# EAGLE schematic 8ChannelIoTLEDDriver (EAGLE 9.6.2)
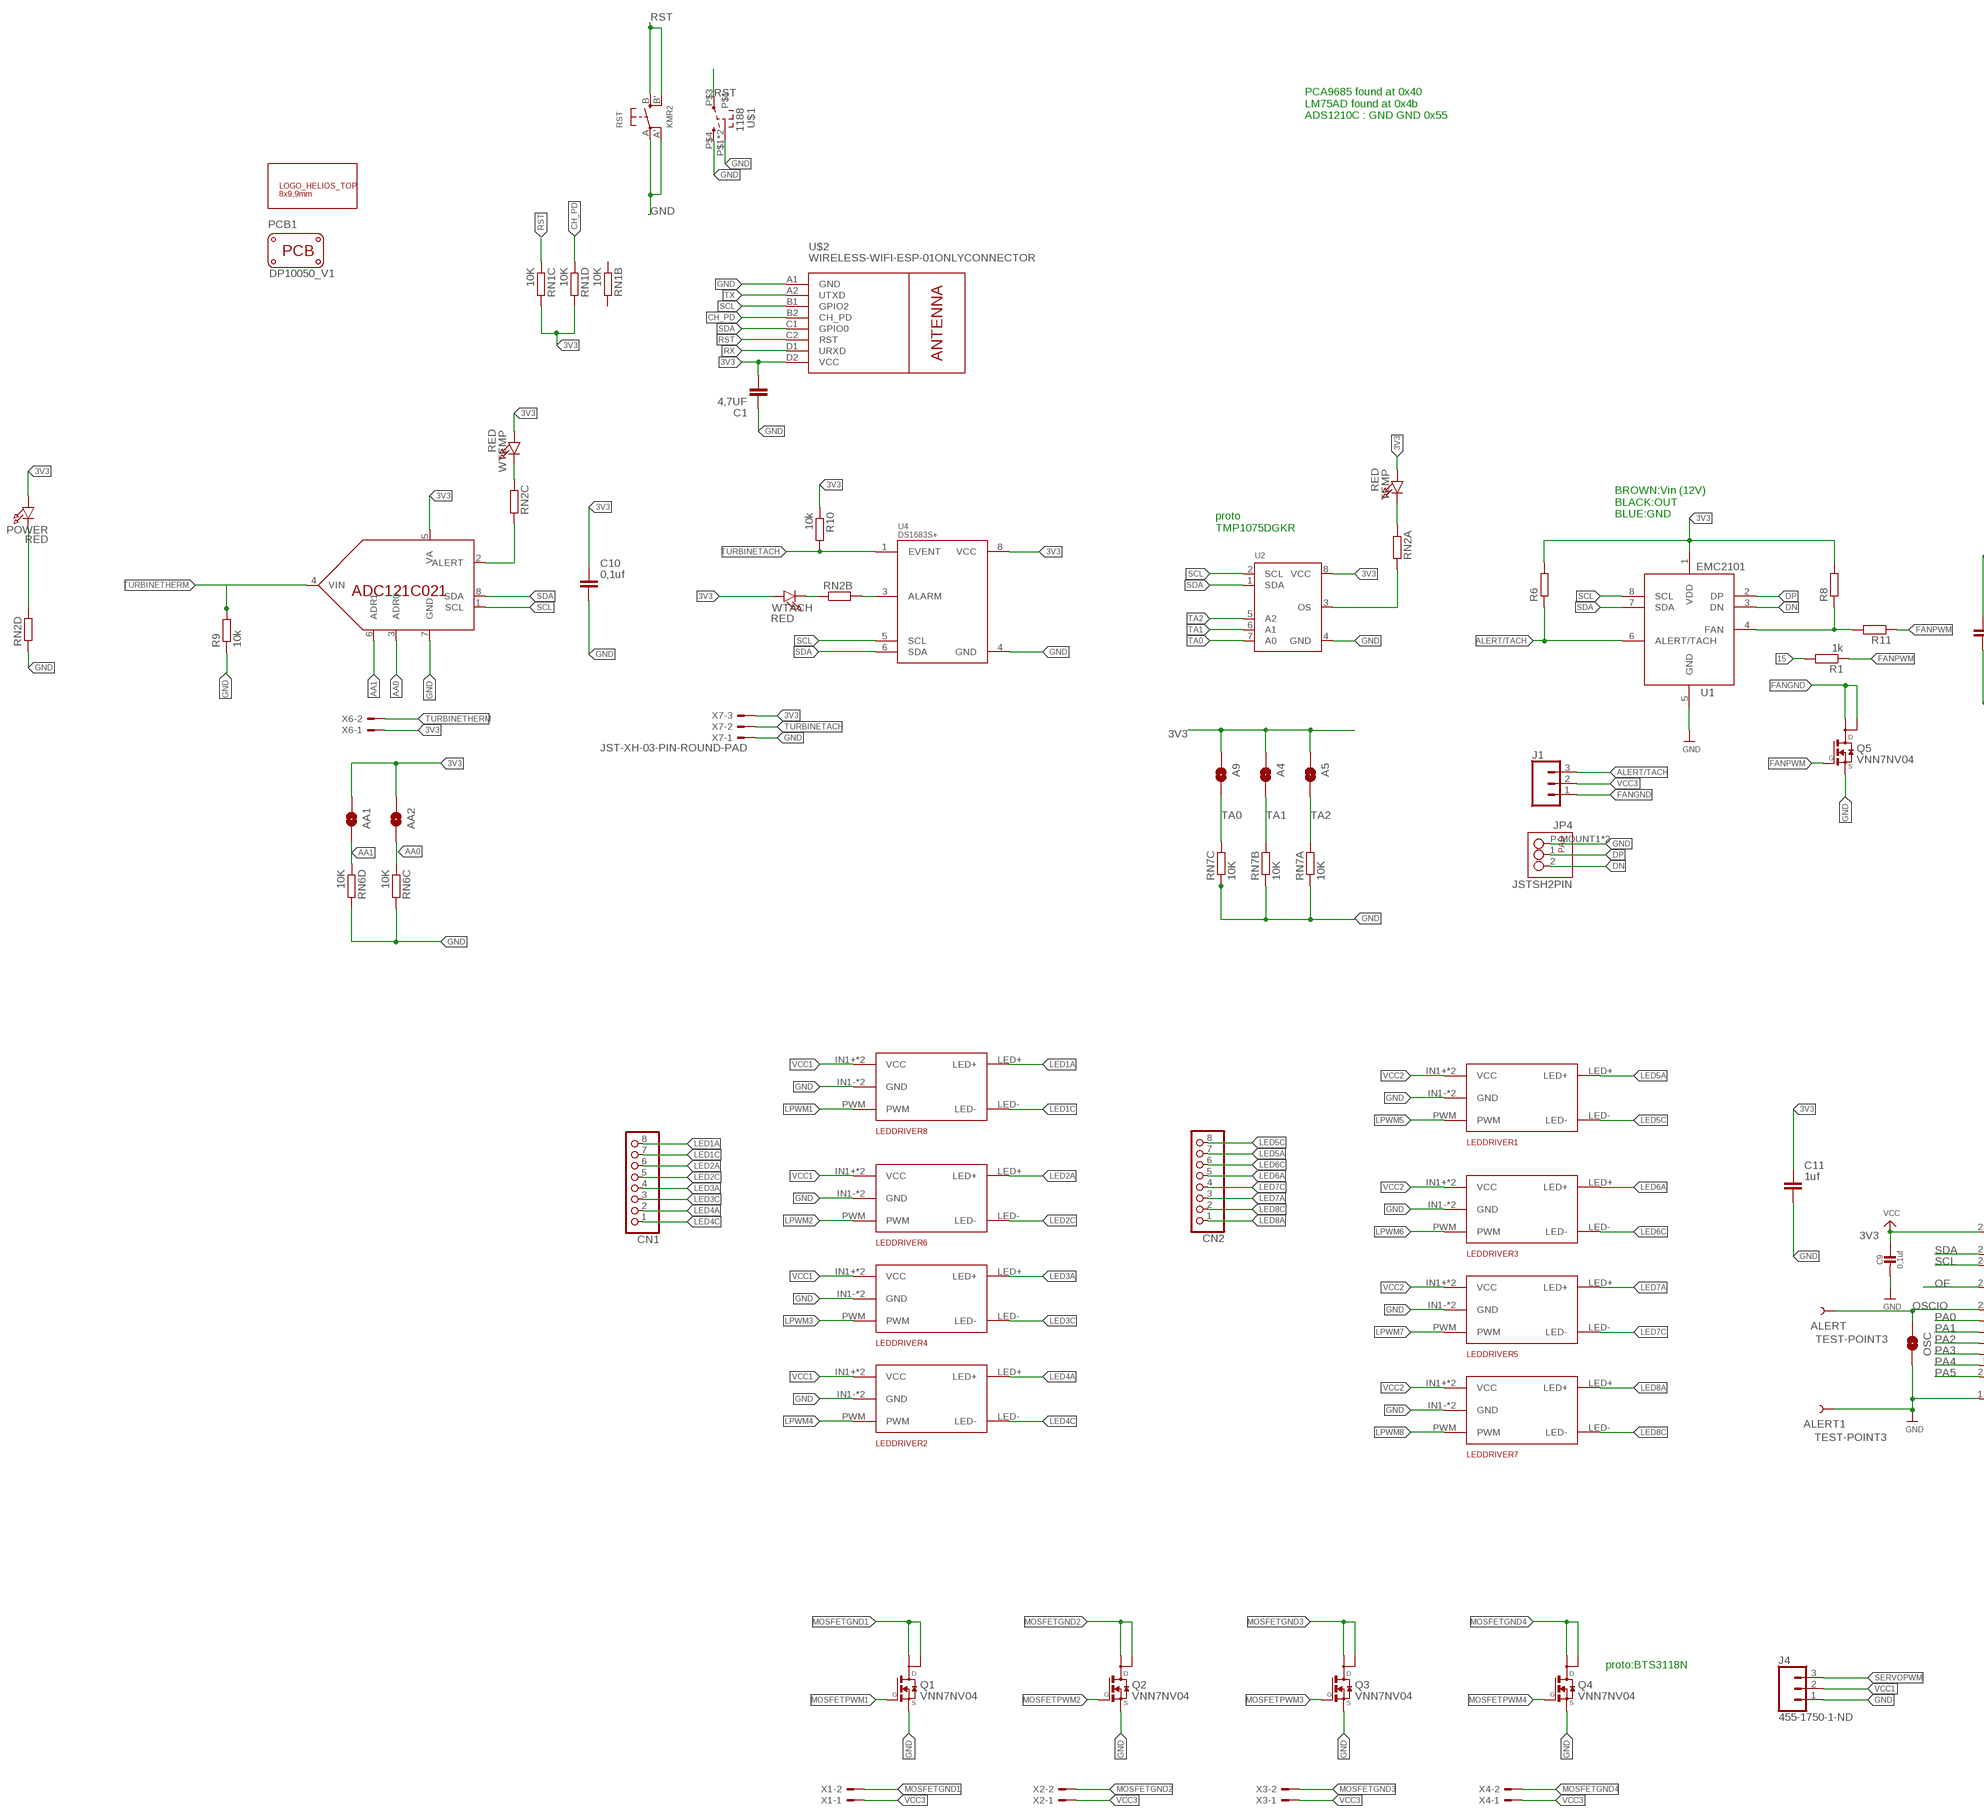
[diagram p0: schematic, sheet 1, part 1 of 2]
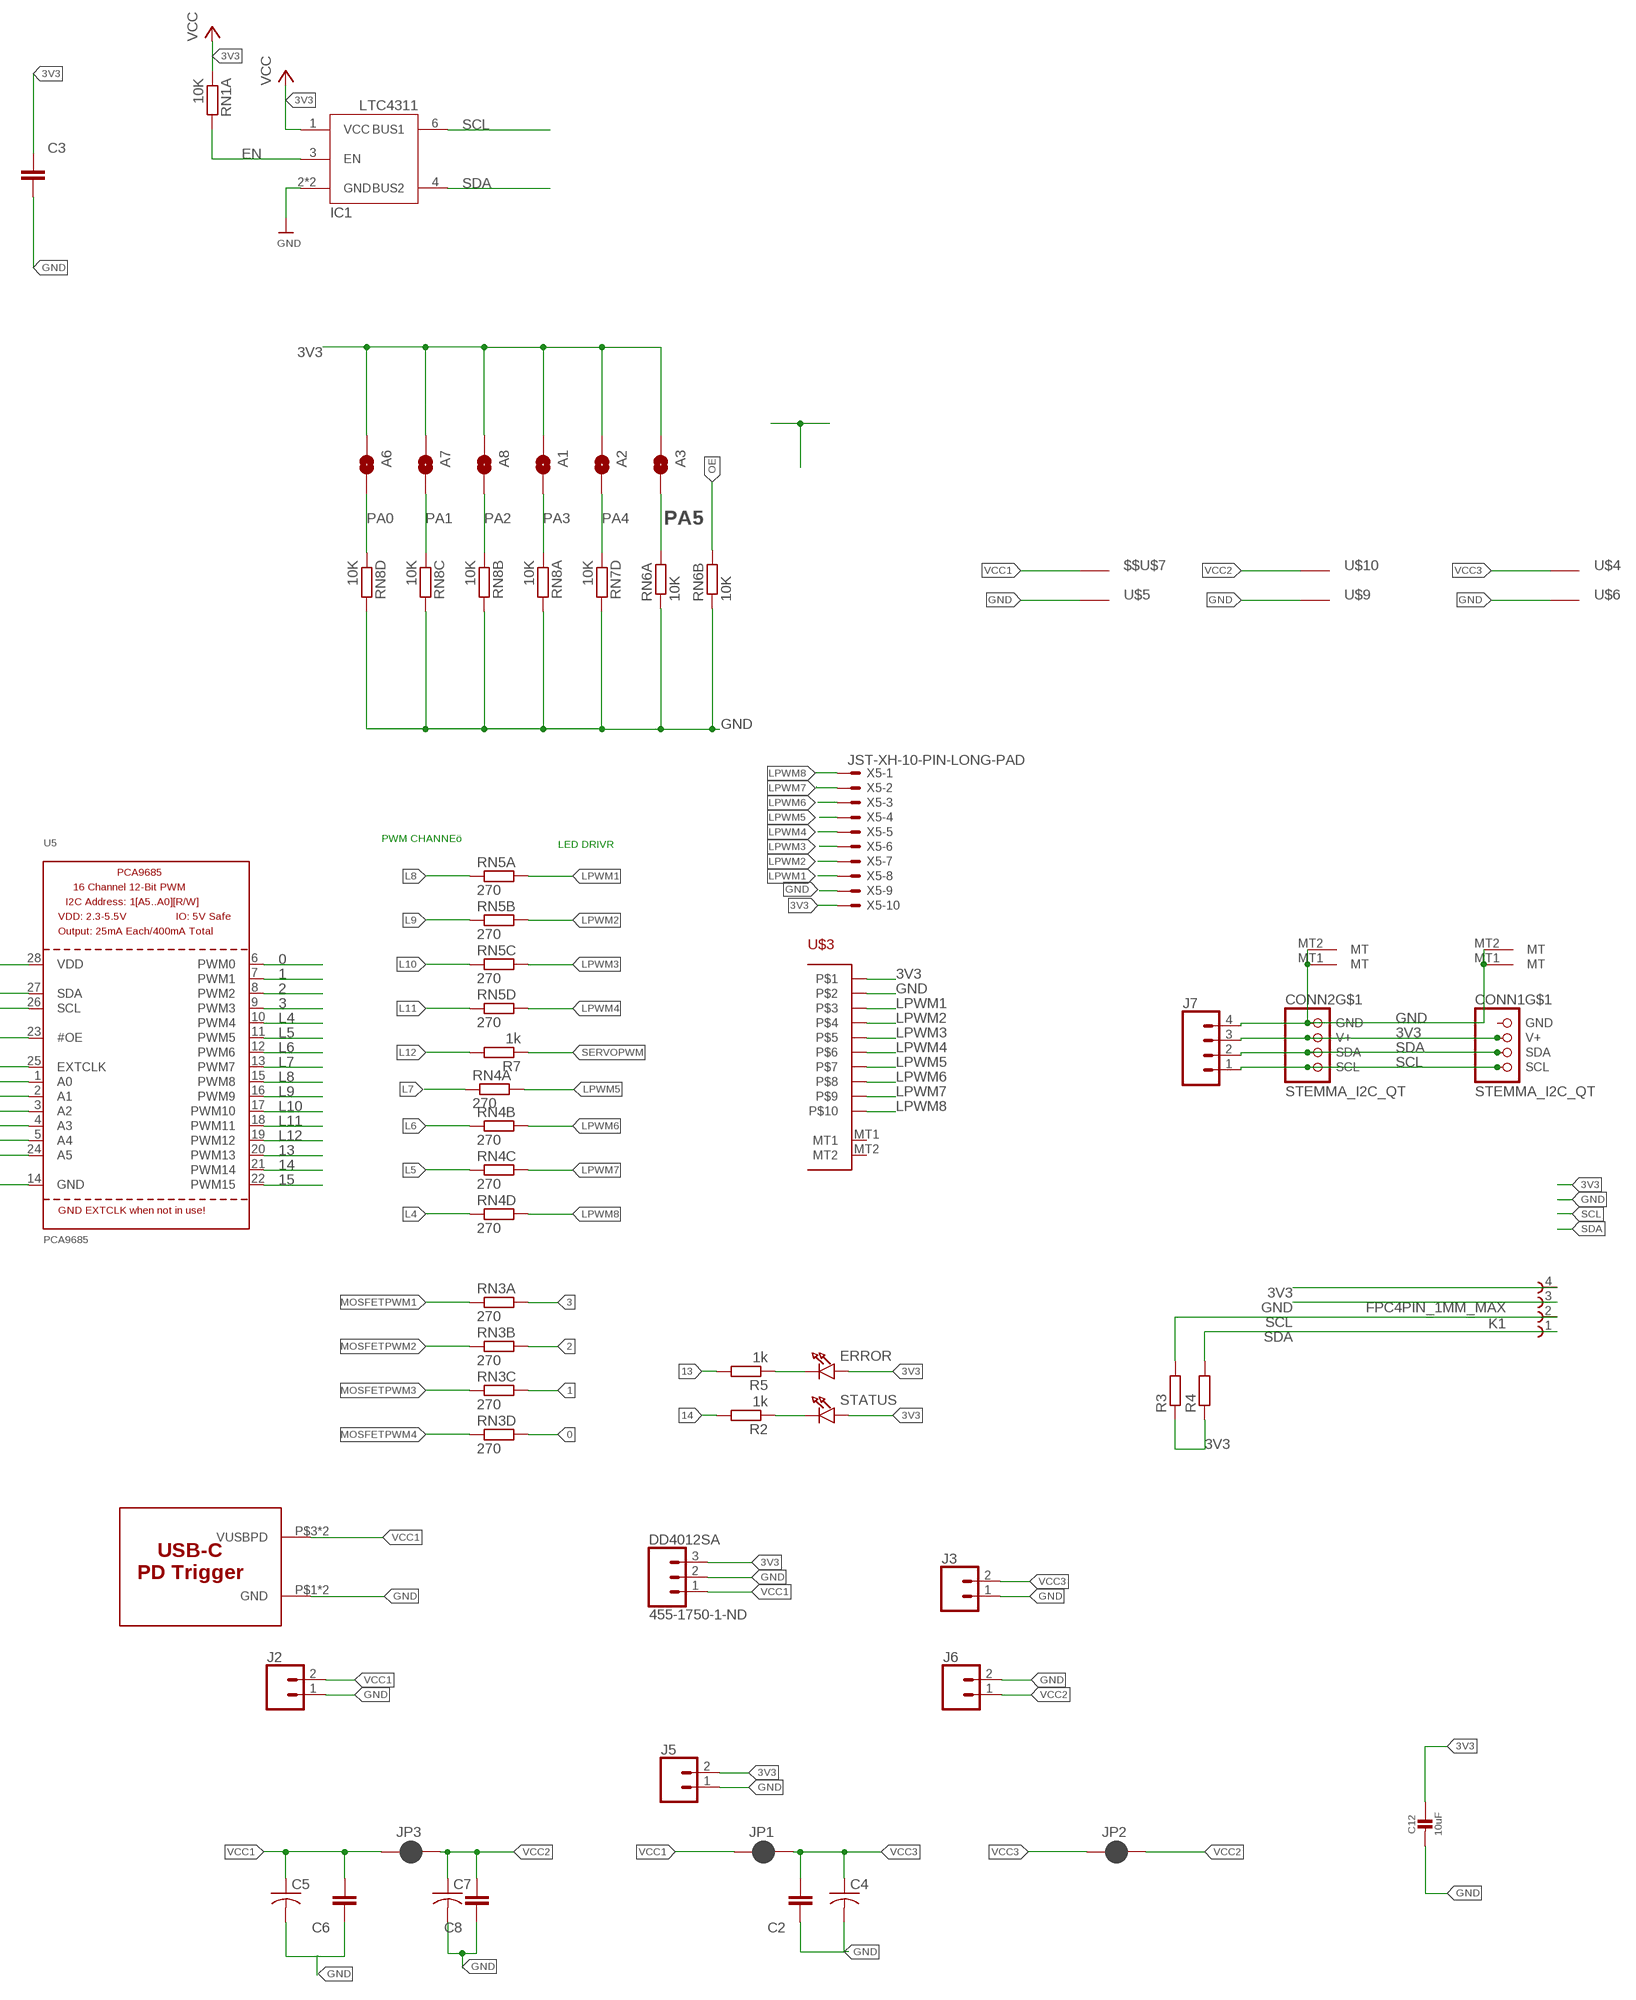
[diagram p1: schematic, sheet 1, part 2 of 2]

## Parts
$$U$7  TESTHOOK  [TESTHOOK]
A1  JUMPER-SMT_2_NO_SILK  [SMT-JUMPER_2_NO_SILK]
A2  JUMPER-SMT_2_NO_SILK  [SMT-JUMPER_2_NO_SILK]
A3  JUMPER-SMT_2_NO_SILK  [SMT-JUMPER_2_NO_SILK]
A4  JUMPER-SMT_2_NO_SILK  [SMT-JUMPER_2_NO_SILK]
A5  JUMPER-SMT_2_NO_SILK  [SMT-JUMPER_2_NO_SILK]
A6  JUMPER-SMT_2_NO_SILK  [SMT-JUMPER_2_NO_SILK]
A7  JUMPER-SMT_2_NO_SILK  [SMT-JUMPER_2_NO_SILK]
A8  JUMPER-SMT_2_NO_SILK  [SMT-JUMPER_2_NO_SILK]
A9  JUMPER-SMT_2_NO_SILK  [SMT-JUMPER_2_NO_SILK]
AA1  JUMPER-SMT_2_NO_SILK  [SMT-JUMPER_2_NO_SILK]
AA2  JUMPER-SMT_2_NO_SILK  [SMT-JUMPER_2_NO_SILK]
ALERT  TEST-POINT3  [PAD.03X.03]
ALERT1  TEST-POINT3  [PAD.03X.03]
C1  4,7UF  CAPACITOR_NPOL-0805  [C805]
C2  CAPACITOR_NPOL-0805  [C805]
C3  CAPACITOR_NPOL-0805  [C805]
C4  C-USC1210  [C1210]
C5  C-USC1210  [C1210]
C6  CAPACITOR_NPOL-0805  [C805]
C7  C-USC1210  [C1210]
C8  CAPACITOR_NPOL-0805  [C805]
C9  0,1uf  CAP_CERAMIC0805-NOOUTLINE  [0805-NO]
C10  0,1uf  CAPACITOR_NPOL-0805  [C805]
C11  1uf  CAPACITOR_NPOL-0805  [C805]
C12  10uF  CAP_CERAMIC0805-NOOUTLINE  [0805-NO]
CN1  JST_8PIN  [JSTPH8]
CN2  JST_8PIN  [JSTPH8]
CONN1  STEMMA_I2C_QT  [JST_SH4]
CONN2  STEMMA_I2C_QT  [JST_SH4]
DD4012SA  455-1750-1-ND  CONN_03  [1X03]
ERROR  RED  LED0805  [CHIPLED_0805]
IC1  LTC4311_SC70  [SC70-6L]
J1  CONN_03POLAR  [MOLEX-1X3]
J2  CONN_02POLAR  [MOLEX-1X2]
J3  CONN_02POLAR  [MOLEX-1X2]
J4  455-1750-1-ND  CONN_03  [1X03]
J5  CONN_02POLAR  [MOLEX-1X2]
J6  CONN_023.5MM  [SCREWTERMINAL-3.5MM-2]
J7  CONN_04JST-PH-4-1.0MM  [JST-4-SMD-VERT-1.0MM]
JP1  JUMPER-SMT_2_NC_PASTE_SILK  [SMT-JUMPER_2_NC_PASTE_SILK]
JP2  JUMPER-SMT_2_NC_PASTE_SILK  [SMT-JUMPER_2_NC_PASTE_SILK]
JP3  JUMPER-SMT_2_NC_PASTE_SILK  [SMT-JUMPER_2_NC_PASTE_SILK]
JP4  JSTSH2PIN  [SM02B-SRSS-TB]
K1  FPC4PIN_1MM_MAX  [FPC_CONN_DOC_4PIN_ENLARGED]
LEDDRIVER1  LEDDRIVERPT4115LONG  [7PINLONGLEDDRIVER]
LEDDRIVER2  LEDDRIVERPT4115LONG  [7PINLONGLEDDRIVER]
LEDDRIVER3  LEDDRIVERPT4115LONG  [7PINLONGLEDDRIVER]
LEDDRIVER4  LEDDRIVERPT4115LONG  [7PINLONGLEDDRIVER]
LEDDRIVER5  LEDDRIVERPT4115LONG  [7PINLONGLEDDRIVER]
LEDDRIVER6  LEDDRIVERPT4115LONG  [7PINLONGLEDDRIVER]
LEDDRIVER7  LEDDRIVERPT4115LONG  [7PINLONGLEDDRIVER]
LEDDRIVER8  LEDDRIVERPT4115LONG  [7PINLONGLEDDRIVER]
OSC  JUMPER-SMT_2_NO_SILK  [SMT-JUMPER_2_NO_SILK]
PCB1  PCB_DP_RECTANGLE-50X100  [DP10050_V1]
POWER  RED  LED0805  [CHIPLED_0805]
Q1  VNN7NV04  [SOT223]
Q2  VNN7NV04  [SOT223]
Q3  VNN7NV04  [SOT223]
Q4  VNN7NV04  [SOT223]
Q5  VNN7NV04  [SOT223]
R1  1k  RESISTORR805-0805  [R805]
R2  1k  RESISTORR805-0805  [R805]
R3  RESISTORR805-0805  [R805]
R4  RESISTORR805-0805  [R805]
R5  1k  RESISTORR805-0805  [R805]
R6  RESISTORR805-0805  [R805]
R7  1k  RESISTORR805-0805  [R805]
R8  RESISTORR805-0805  [R805]
R9  10k  RESISTORR805-0805  [R805]
R10  10k  RESISTORR805-0805  [R805]
R11  RESISTORR805-0805  [R805]
RN1  10K  RESISTOR_ARRAY_4  [RN8P-4R-CRA06S]
RN2  RESISTOR_ARRAY_4  [RN8P-4R-CRA06S]
RN3  270  RESISTOR_ARRAY_4  [RN8P-4R-CRA06S]
RN4  270  RESISTOR_ARRAY_4  [RN8P-4R-CRA06S]
RN5  270  RESISTOR_ARRAY_4  [RN8P-4R-CRA06S]
RN6  10K  RESISTOR_ARRAY_4  [RN8P-4R-CRA06S]
RN7  10K  RESISTOR_ARRAY_4  [RN8P-4R-CRA06S]
RN8  10K  RESISTOR_ARRAY_4  [RN8P-4R-CRA06S]
RST  KMR2  SWITCH_TACT_SMT4.6X2.8  [BTN_KMR2_4.6X2.8]
STATUS  RED  LED0805  [CHIPLED_0805]
TEMP  RED  LED0805  [CHIPLED_0805]
U1  EMC2101-AZCL  [MSOP8_0.65MM]
U2  TEMP_LM75B  [TSSOP8]
U3  ADC121C021  [MSOP08]
U4  DS1683S+  [SOIC8-N_MC]
U5  PCA9685  [TSSOP28]
U$1  1188  [1188]
U$2  WIRELESS-WIFI-ESP-01ONLYCONNECTOR  [WIRELESS-WIFI-ESP-01-ONLYBOTTOM]
U$3  FPC-1.0X10  [FPC_1.0X10]
U$4  TESTHOOK  [TESTHOOK]
U$5  TESTHOOK  [TESTHOOK]
U$6  TESTHOOK  [TESTHOOK]
U$8  USB_PD_TRIGGER  [USB-PDTRIGGER]
U$9  TESTHOOK  [TESTHOOK]
U$10  TESTHOOK  [TESTHOOK]
U$11  LOGOTOPHELIOS  [LOGOTOPHELIOS]
WTACH  RED  LED0805  [CHIPLED_0805]
WTEMP  RED  LED0805  [CHIPLED_0805]
X1  JST-XH-02-PIN-ROUND-PAD  [JST-XH-02-PACKAGE-ROUND-PAD]
X2  JST-XH-02-PIN-ROUND-PAD  [JST-XH-02-PACKAGE-ROUND-PAD]
X3  JST-XH-02-PIN-ROUND-PAD  [JST-XH-02-PACKAGE-ROUND-PAD]
X4  JST-XH-02-PIN-ROUND-PAD  [JST-XH-02-PACKAGE-ROUND-PAD]
X5  JST-XH-10-PIN-LONG-PAD  [JST-XH-10-PACKAGE-LONG-PAD]
X6  JST-XH-02-PIN-ROUND-PAD  [JST-XH-02-PACKAGE-ROUND-PAD]
X7  JST-XH-03-PIN-ROUND-PAD  [JST-XH-03-PACKAGE-ROUND-PAD]

## Nets
0: RN3.5 U5.6(PWM0)
1: RN3.6 U5.7(PWM1)
2: RN3.7 U5.8(PWM2)
3: RN3.8 U5.9(PWM3)
3V3: A1.1 A2.1 A3.1 A4.1 A5.1 A6.1 A7.1 A8.1 A9.1 AA1.1 AA2.1 C1.2 C3.1 C9.1 C10.1 C11.1 C12.1 CONN1.2(V+) CONN2.2(V+) DD4012SA.3 ERROR.A IC1.1(VCC) J5.2 J7.3 K1.4 POWER.A R3.1 R4.1 R6.2 R8.2 R10.1 RN1.1 RN1.5 RN1.6 STATUS.A TEMP.A U1.1(VDD) U2.8(VCC) U3.5(VA) U4.8(VCC) U5.28(VDD) U$2.D2(VCC) U$3.1 WTACH.A WTEMP.A X5.10 X6.1 X7.3 ; supply symbol labelled VCC
13: R5.2 U5.20(PWM13)
14: R2.2 U5.21(PWM14)
15: R1.2 U5.22(PWM15)
AA0: AA2.2 RN6.3 U3.3(ADR0)
AA1: AA1.2 RN6.4 U3.6(ADR1)
ALARM1: RN2.6 U3.2(ALERT)
ALARM2: RN2.8 U2.3(OS)
ALERT/TACH: J1.3 R6.1 U1.6(ALERT/TACH)
CH_PD: RN1.4 U$2.B2(CH_PD)
DN [ThermoDiode]: JP4.2 U1.3(DN)
DP [ThermoDiode]: JP4.1 U1.2(DP)
EN: IC1.3(EN) RN1.8
FANGND: J1.1 Q5.2(D) Q5.4(D2)
FANPWM: Q5.1(G) R1.1 R11.1
GND: ALERT1.P$1 C1.1 C2.1 C3.2 C4.2 C5.2 C6.1 C7.2 C8.1 C9.2 C10.2 C11.2 C12.2 CONN1.MT1(MT) CONN1.MT2(MT) CONN2.1(GND) CONN2.MT1(MT) CONN2.MT2(MT) DD4012SA.2 IC1.2(GND) IC1.5(GND) J2.1 J3.1 J4.1 J5.1 J6.2 J7.4 JP4.P-MOUNT1 JP4.P-MOUNT2 K1.3 LEDDRIVER1.IN1-(GND) LEDDRIVER1.IN2-(GND) LEDDRIVER2.IN1-(GND) LEDDRIVER2.IN2-(GND) LEDDRIVER3.IN1-(GND) LEDDRIVER3.IN2-(GND) LEDDRIVER4.IN1-(GND) LEDDRIVER4.IN2-(GND) LEDDRIVER5.IN1-(GND) LEDDRIVER5.IN2-(GND) LEDDRIVER6.IN1-(GND) LEDDRIVER6.IN2-(GND) LEDDRIVER7.IN1-(GND) LEDDRIVER7.IN2-(GND) LEDDRIVER8.IN1-(GND) LEDDRIVER8.IN2-(GND) OSC.2 Q1.3(S) Q2.3(S) Q3.3(S) Q4.3(S) Q5.3(S) R9.1 RN2.4 RN6.1 RN6.2 RN6.5 RN6.6 RN7.1 RN7.2 RN7.3 RN7.5 RN8.5 RN8.6 RN8.7 RN8.8 RST.A'(P1) RST.A(P) U1.5(GND) U2.4(GND) U3.7(GND) U4.4(GND) U5.14(GND) U$1.P$1 U$1.P$2 U$1.P$4 U$2.A1(GND) U$3.2 U$5.P$1 U$6.P$1 U$8.P$1(GND) U$8.P$2(GND) U$9.P$1 X5.9 X7.1
L4: RN4.4 U5.10(PWM4)
L5: RN4.3 U5.11(PWM5)
L6: RN4.2 U5.12(PWM6)
L7: RN4.1 U5.13(PWM7)
L8: RN5.1 U5.15(PWM8)
L9: RN5.2 U5.16(PWM9)
L10: RN5.3 U5.17(PWM10)
L11: RN5.4 U5.18(PWM11)
L12: R7.2 U5.19(PWM12)
LED1A: CN1.8 LEDDRIVER8.LED+
LED1C: CN1.7 LEDDRIVER8.LED-
LED2A: CN1.6 LEDDRIVER6.LED+
LED2C: CN1.5 LEDDRIVER6.LED-
LED3A: CN1.4 LEDDRIVER4.LED+
LED3C: CN1.3 LEDDRIVER4.LED-
LED4A: CN1.2 LEDDRIVER2.LED+
LED4C: CN1.1 LEDDRIVER2.LED-
LED5A: CN2.7 LEDDRIVER1.LED+
LED5C: CN2.8 LEDDRIVER1.LED-
LED6A: CN2.5 LEDDRIVER3.LED+
LED6C: CN2.6 LEDDRIVER3.LED-
LED7A: CN2.3 LEDDRIVER5.LED+
LED7C: CN2.4 LEDDRIVER5.LED-
LED8A: CN2.1 LEDDRIVER7.LED+
LED8C: CN2.2 LEDDRIVER7.LED-
LPWM1: LEDDRIVER8.PWM RN5.8 U$3.3 X5.8
LPWM2: LEDDRIVER6.PWM RN5.7 U$3.4 X5.7
LPWM3: LEDDRIVER4.PWM RN5.6 U$3.5 X5.6
LPWM4: LEDDRIVER2.PWM RN5.5 U$3.6 X5.5
LPWM5: LEDDRIVER1.PWM RN4.8 U$3.7 X5.4
LPWM6: LEDDRIVER3.PWM RN4.7 U$3.8 X5.3
LPWM7: LEDDRIVER5.PWM RN4.6 U$3.9 X5.2
LPWM8: LEDDRIVER7.PWM RN4.5 U$3.10 X5.1
MOSFETGND1: Q1.2(D) Q1.4(D2) X1.2
MOSFETGND2: Q2.2(D) Q2.4(D2) X2.2
MOSFETGND3: Q3.2(D) Q3.4(D2) X3.2
MOSFETGND4: Q4.2(D) Q4.4(D2) X4.2
MOSFETPWM1: Q1.1(G) RN3.1
MOSFETPWM2: Q2.1(G) RN3.2
MOSFETPWM3: Q3.1(G) RN3.3
MOSFETPWM4: Q4.1(G) RN3.4
N$1: RN2.1 TEMP.C
N$3: RN2.2 WTACH.C
N$4: RN2.3 WTEMP.C
N$5: RN2.7 U4.3(ALARM)
N$6: POWER.C RN2.5
N$120: R8.1 R11.2 U1.4(FAN)
N$323: R2.1 STATUS.C
N$324: ERROR.C R5.1
OE: RN6.7 U5.23(#OE)
OSCIO: ALERT.P$1 OSC.1 U5.25(EXTCLK)
PA0: A6.2 RN8.4 U5.1(A0)
PA1: A7.2 RN8.3 U5.2(A1)
PA2: A8.2 RN8.2 U5.3(A2)
PA3: A1.2 RN8.1 U5.4(A3)
PA4: A2.2 RN7.4 U5.5(A4)
PA5: A3.2 RN6.8 U5.24(A5)
RST: RN1.3 RST.B'(S1) RST.B(S) U$1.P$3 U$2.C2(RST)
RX: U$2.D1(URXD)
SCL: CONN1.4(SCL) CONN2.4(SCL) IC1.6(BUS1) J7.1 K1.2 R3.2 U1.8(SCL) U2.2(SCL) U3.1(SCL) U4.5(SCL) U5.26(SCL) U$2.B1(GPIO2)
SDA: CONN1.3(SDA) CONN2.3(SDA) IC1.4(BUS2) J7.2 K1.1 R4.2 U1.7(SDA) U2.1(SDA) U3.8(SDA) U4.6(SDA) U5.27(SDA) U$2.C1(GPIO0)
SERVOPWM: J4.3 R7.1
TA0: A9.2 RN7.6 U2.7(A0)
TA1: A4.2 RN7.7 U2.6(A1)
TA2: A5.2 RN7.8 U2.5(A2)
TURBINETACH: R10.2 U4.1(EVENT) X7.2
TURBINETHERM: R9.2 U3.4(VIN) X6.2
TX: U$2.A2(UTXD)
VCC1: $$U$7.P$1 C5.1 C6.2 DD4012SA.1 J2.2 J4.2 JP1.1 JP3.1 LEDDRIVER2.IN1+(VCC) LEDDRIVER2.IN2+(VCC) LEDDRIVER4.IN1+(VCC) LEDDRIVER4.IN2+(VCC) LEDDRIVER6.IN1+(VCC) LEDDRIVER6.IN2+(VCC) LEDDRIVER8.IN1+(VCC) LEDDRIVER8.IN2+(VCC) U$8.P$3(VUSBPD) U$8.P$4(VUSBPD)
VCC2: C7.1 C8.2 J6.1 JP2.2 JP3.2 LEDDRIVER1.IN1+(VCC) LEDDRIVER1.IN2+(VCC) LEDDRIVER3.IN1+(VCC) LEDDRIVER3.IN2+(VCC) LEDDRIVER5.IN1+(VCC) LEDDRIVER5.IN2+(VCC) LEDDRIVER7.IN1+(VCC) LEDDRIVER7.IN2+(VCC) U$10.P$1
VCC3: C2.2 C4.1 J1.2 J3.2 JP1.2 JP2.1 U$4.P$1 X1.1 X2.1 X3.1 X4.1
Unconnected: CONN1.1(GND) RN1.2 RN1.7 U$3.MT1 U$3.MT2

## Notes on the sheet
- PCA9685 found at 0x40
  LM75AD found at 0x4b
  ADS1210C : GND GND 0x55
- BROWN:Vin (12V)
  BLACK:OUT
  BLUE:GND
- proto
  TMP1075DGKR
- PWM CHANNEö
- LED DRIVR
- proto:BTS3118N

## Library data of the parts
$$U$7 U$4-U$6 U$9 U$10 = pimoroni-connectors:TESTHOOK
A1-A9 AA1 AA2 OSC = SparkFun-Jumpers:JUMPER-SMT_2_NO: Normally open jumper This jumper has two pads in close proximity to each other. Apply solder to close the connection. Round pads are easier to solder for beginners, but are a lot larger. SparkFun Product that uses the round pads: SparkFun EL Sequencer <https://www.sparkfun.com/products/12781>
ALERT ALERT1 = SparkFun-Connectors:TEST-POINT: SparkFun Test Points Bare copper test points for troubleshooting or In-Circuit-Testing. These are used by our Production team for verifying production board runs using pogo-pins on test beds. SparkFun Products: SparkFun LSM9DS1 Breakout <https://www.sparkfun.com/products/13284> SparkFun PSOC <https://www.sparkfun.com/products/13714> SparkFun Load Cell Amplifier <https://www.sparkfun.com/products/13879>
C1-C3 C6 C8 C10 C11 = dp_devices:CAPACITOR_NPOL: Non-Polarized capacitor in various packages
C4 C5 C7 = adafruit:C-US: CAPACITOR, American symbol
C9 C12 = microbuilder:CAP_CERAMIC: Ceramic Capacitors For new designs, use the packages preceded by an '_' character since they are more reliable: The following footprints should be used on most boards: _0402 - Standard footprint for regular board layouts _0603 - Standard footprint for regular board layouts _0805 - Standard footprint for regular board layouts _1206 - Standard footprint for regular board layouts For extremely tight-pitch boards where space is at a premium, the following 'micro-pitch' footprints can be used (smaller pads, no silkscreen outline, etc.): _0402MP - Micro-pitch footprint for very dense/compact boards _0603MP - Micro-pitch footprint for very dense/compact boards _0805MP - Micro-pitch footprint for very dense/compact boards _1206MP - Micro-pitch footprint for very dense/compact boards
CN1 CN2 = microbuilder:JST_8PIN: JST 8-Pin Right-Angle Connector
CONN1 CONN2 = microbuilder:STEMMA_I2C
DD4012SA J4 = SparkFun-Connectors:CONN_03: Multi connection point. Often used as Generic Header-pin footprint for 0.1 inch spaced/style header connections On any of the 0.1 inch spaced packages, you can populate with these: Break Away Headers - Straight <https://www.sparkfun.com/products/116> (PRT-00116) Break Away Male Headers - Right Angle <https://www.sparkfun.com/products/553> (PRT-00553) Female Headers <https://www.sparkfun.com/products/115> (PRT-00115) Break Away Headers - Machine Pin <https://www.sparkfun.com/products/117> (PRT-00117) Break Away Female Headers - Swiss Machine Pin <https://www.sparkfun.com/products/743> (PRT-00743) Stackable Header - 3 Pin (Female, 0.1") <https://www.sparkfun.com/products/13875> (PRT-13875) For SCREWTERMINALS and SPRING TERMINALS visit here: Screw Terimnals on SparkFun.com <https://www.sparkfun.com/search/results?term=Screw+Terminals> (5mm/3.5mm/2.54mm spacing) This device is also useful as a general connection point to wire up your design to another part of your project. Our various solder wires solder well into these plated through hole pads. Hook-Up Wire - Assortment (Stranded, 22 AWG) <https://www.sparkfun.com/products/11375> (PRT-11375) Hook-Up Wire - Assortment (Solid Core, 22 AWG) <https://www.sparkfun.com/products/11367> (PRT-11367) View the entire wire category on our website here <https://www.sparkfun.com/categories/141> Special notes: Molex polarized connector foot print use with SKU : PRT-08232 with associated crimp pins and housings.; PROD_ID: XXX-00000
ERROR POWER STATUS TEMP WTACH WTEMP = microbuilder:LED: LED 0603 - 0603 Surface Mount Package 2mA: Green LED - Low Power (3.9mcd, 2ma, 1.7Vf) - Digikey: 475-2709-2-ND Orange LED - Low Power (9.8mcd, 2ma, 1.8Vf) - Digikey: 475-1194-2-ND Red LED - Low Power (5mcd, 2ma, 1.8Vf) - Digikey: 475-1195-2-ND Yellow LED - Low Power (7mcd, 2ma, 1.8Vf) - Digikey: 475-1196-2-ND 5mA: Blue LED - Low Power (17mcd, 5ma, 2.9Vf) - Digikey: LNJ937W8CRACT-ND 0805 - 0805 Surface Mount Package 2mA: Red LED (8.8mcd, 2mA, 1.8Vf, Clear) - Low Power [Digikey: 475-2510-1-ND] Green LED (5mcd, 2mA, 1.8Vf, Clear) - Low Power [Digikey: 475-2730-1-ND] Yellow LED (11.3mcd, 2mA, 1.8Vf, Clear) - Low Power [Digikey: 475-2555-1-ND] 20mA: Red LED (104mcd, 20mA, Diffused) - LS R976 [Digikey: 475-1278-6-ND] Red LED (12mcd, 20mA, 2.0Vf, Clear) - APT2012EC [Digikey: 754-1128-1-ND] Green LED (15mcd, 20mA, 2.2Vf, Clear) - APT2012GC [Digikey: 754-1131-1-ND] Orange LED (160mcd, 20mA, 2.1Vf, Clear) - APT2012SECK [Digikey: 754-1130-1-ND] 1206 - 1206 Surface Mount Package Green LED (26mcd, 20mA, Diffused) - LG N971 [Digikey: 475-1407-6-ND] Red LED (15mcd, 20mA, Diffused) - LH N974 [Digikey: 475-1416-6-ND]
IC1 = microbuilder:LTC4311
J1 = SparkFun-Connectors:CONN_03: Multi connection point. Often used as Generic Header-pin footprint for 0.1 inch spaced/style header connections On any of the 0.1 inch spaced packages, you can populate with these: Break Away Headers - Straight <https://www.sparkfun.com/products/116> (PRT-00116) Break Away Male Headers - Right Angle <https://www.sparkfun.com/products/553> (PRT-00553) Female Headers <https://www.sparkfun.com/products/115> (PRT-00115) Break Away Headers - Machine Pin <https://www.sparkfun.com/products/117> (PRT-00117) Break Away Female Headers - Swiss Machine Pin <https://www.sparkfun.com/products/743> (PRT-00743) Stackable Header - 3 Pin (Female, 0.1") <https://www.sparkfun.com/products/13875> (PRT-13875) For SCREWTERMINALS and SPRING TERMINALS visit here: Screw Terimnals on SparkFun.com <https://www.sparkfun.com/search/results?term=Screw+Terminals> (5mm/3.5mm/2.54mm spacing) This device is also useful as a general connection point to wire up your design to another part of your project. Our various solder wires solder well into these plated through hole pads. Hook-Up Wire - Assortment (Stranded, 22 AWG) <https://www.sparkfun.com/products/11375> (PRT-11375) Hook-Up Wire - Assortment (Solid Core, 22 AWG) <https://www.sparkfun.com/products/11367> (PRT-11367) View the entire wire category on our website here <https://www.sparkfun.com/categories/141> Special notes: Molex polarized connector foot print use with SKU : PRT-08232 with associated crimp pins and housings.; PROD_ID: CONN-08625; SF_ID: PRT-08096
J2 J3 J5 = SparkFun-Connectors:CONN_02: Multi connection point. Often used as Generic Header-pin footprint for 0.1 inch spaced/style header connections On any of the 0.1 inch spaced packages, you can populate with these: Break Away Headers - Straight <https://www.sparkfun.com/products/116> (PRT-00116) Break Away Male Headers - Right Angle <https://www.sparkfun.com/products/553> (PRT-00553) Female Headers <https://www.sparkfun.com/products/115> (PRT-00115) Break Away Headers - Machine Pin <https://www.sparkfun.com/products/117> (PRT-00117) Break Away Female Headers - Swiss Machine Pin <https://www.sparkfun.com/products/743> (PRT-00743) For SCREWTERMINALS and SPRING TERMINALS visit here: Screw Terimnals on SparkFun.com <https://www.sparkfun.com/search/results?term=Screw+Terminals> (5mm/3.5mm/2.54mm spacing) This device is also useful as a general connection point to wire up your design to another part of your project. Our various solder wires solder well into these plated through hole pads. Hook-Up Wire - Assortment (Stranded, 22 AWG) <https://www.sparkfun.com/products/11375> (PRT-11375) Hook-Up Wire - Assortment (Solid Core, 22 AWG) <https://www.sparkfun.com/products/11367> (PRT-11367) View the entire wire category on our website here <https://www.sparkfun.com/categories/141> Special notes: Molex polarized connector foot print use with: PRT-08233 with associated crimp pins and housings. 2.54_SCREWTERM for use with PRT-10571. 3.5mm Screw Terminal footprints for PRT-08084 5mm Screw Terminal footprints for use with PRT-08432; SF_ID: PRT-09918
J6 = SparkFun-Connectors:CONN_02: Multi connection point. Often used as Generic Header-pin footprint for 0.1 inch spaced/style header connections On any of the 0.1 inch spaced packages, you can populate with these: Break Away Headers - Straight <https://www.sparkfun.com/products/116> (PRT-00116) Break Away Male Headers - Right Angle <https://www.sparkfun.com/products/553> (PRT-00553) Female Headers <https://www.sparkfun.com/products/115> (PRT-00115) Break Away Headers - Machine Pin <https://www.sparkfun.com/products/117> (PRT-00117) Break Away Female Headers - Swiss Machine Pin <https://www.sparkfun.com/products/743> (PRT-00743) For SCREWTERMINALS and SPRING TERMINALS visit here: Screw Terimnals on SparkFun.com <https://www.sparkfun.com/search/results?term=Screw+Terminals> (5mm/3.5mm/2.54mm spacing) This device is also useful as a general connection point to wire up your design to another part of your project. Our various solder wires solder well into these plated through hole pads. Hook-Up Wire - Assortment (Stranded, 22 AWG) <https://www.sparkfun.com/products/11375> (PRT-11375) Hook-Up Wire - Assortment (Solid Core, 22 AWG) <https://www.sparkfun.com/products/11367> (PRT-11367) View the entire wire category on our website here <https://www.sparkfun.com/categories/141> Special notes: Molex polarized connector foot print use with: PRT-08233 with associated crimp pins and housings. 2.54_SCREWTERM for use with PRT-10571. 3.5mm Screw Terminal footprints for PRT-08084 5mm Screw Terminal footprints for use with PRT-08432; PROD_ID: CONN-08399
J7 = SparkFun-Connectors:CONN_04: Multi connection point. Often used as Generic Header-pin footprint for 0.1 inch spaced/style header connections On any of the 0.1 inch spaced packages, you can populate with these: Break Away Headers - Straight <https://www.sparkfun.com/products/116> (PRT-00116) Break Away Male Headers - Right Angle <https://www.sparkfun.com/products/553> (PRT-00553) Female Headers <https://www.sparkfun.com/products/115> (PRT-00115) Break Away Headers - Machine Pin <https://www.sparkfun.com/products/117> (PRT-00117) Break Away Female Headers - Swiss Machine Pin <https://www.sparkfun.com/products/743> (PRT-00743) For SCREWTERMINALS and SPRING TERMINALS visit here: Screw Terimnals on SparkFun.com <https://www.sparkfun.com/search/results?term=Screw+Terminals> (5mm/3.5mm/2.54mm spacing) This device is also useful as a general connection point to wire up your design to another part of your project. Our various solder wires solder well into these plated through hole pads. Hook-Up Wire - Assortment (Stranded, 22 AWG) <https://www.sparkfun.com/products/11375> (PRT-11375) Hook-Up Wire - Assortment (Solid Core, 22 AWG) <https://www.sparkfun.com/products/11367> (PRT-11367) View the entire wire category on our website here <https://www.sparkfun.com/categories/141> Special notes: Molex polarized connector foot print use with SKU : PRT-08231 with associated crimp pins and housings. 1MM SMD Version SKU: PRT-10208
JP1-JP3 = SparkFun-Jumpers:JUMPER-SMT_2_NC_PASTE: Normally closed solder jumper This jumper has an aperture in the stencil to allow solder paste to bridge the split in the wire so it's normally closed (NC). Wick off the solder to open the connection. Reapply solder to reclose the connection.
JP4 = con-jst-shMax:JSTSH2PIN
K1 = FPCMax:FPC4PIN_1MM_MAX: WR-FPC 1.00mm SMT ZIF Horizontal Bottom Contact, 4 Pins=>Code : Con_FPC_ZIF_1.00_68610414422 <http://katalog.we-online.de/media/images/eican/Con_FPC_ZIF_1.00_6861xx14422_pf2.jpg> Details see: http://katalog.we-online.de/en/em/686_1xx_144_22 Created 2014-07-09, Karrer Zheng 2014 (C) Würth Elektronik
LEDDRIVER1-LEDDRIVER8 = MyBreadBoards:LEDDRIVERPT4115LONG
PCB1 = dp_devices:PCB_DP_RECTANGLE: Dangerous Prototypes Standard Rectangular PCB sizes; PCB_SIZE: DP10050_V1
Q1-Q5 = VNN7NV04:VNN7NV04: POWER MOSFET N-CH OMNIFET-II 40V 6A SOT223; AVAILABILITY: Unavailable; DESCRIPTION: Power Switch/Driver 1:1 N-Channel 6A SOT-223; MF: STMicroelectronics; MP: VNN7NV04; PACKAGE: None; PRICE: None
R1-R11 = dp_devices:RESISTOR
RN1-RN8 = dp_devices:RESISTOR_ARRAY_4: 4 Resistor Array 0603
RST = microbuilder:SWITCH_TACT_SMT: SMT Tact Switches 6x6mm - Digikey: P12940SCT-ND KMR2 (4.6x2.8mm) - Digikey: 401-1426-1-ND EVQ-PQHB55 - Light Touch, 160GF (4.5x4.5mm) - Digikey: P8090SCT-ND
U1 = adafruit_sensor:EMC2101
U2 = microbuilder:TEMP_LM75B: LM75B I2C Temperature Sensor The I2C-based LM75B can measure temperature between -55 and 125°C in 0.125°C increments (11-bit resolution). Digikey: 568-4768-1-ND For a 1.8V compatible part, look at the following pin and SW compatible parts: DS75LV - Mouser: 700-DS75LVS, Digikey: (TSSOP8) DS75LVU+-ND (SOIC8) DS75LVS+-ND
U3 = AlexW-Eagle-Libraries:ADC121C021: ADC121C021 National Instruments I2C-Compatible 12-bit Analog-to-Digital converter with alert.
U4 = OMAT_IC:DS1683
U5 = microbuilder:PCA9685: PCA9685 - 16 Channel 12-Bit I2C PWM Controller 5.0V tolerant 16 channel, 12-bit I2C PWM controller with 25mA per output (max. 400mA total) Digikey: 568-5931-1-ND
U$1 = SwitchMax:1188
U$2 = diy-modules:WIRELESS-WIFI-ESP-01: Wireless Wi-Fi ESP-01 Module based on ESP8266 chip Click here to find device on ebay.com <http://www.ebay.com/sch/esp8266+esp+01+transceiver>
U$3 = pimoroni-connectors:FPC-1.0X10
U$8 = MyBreadBoards:USB_PD_TRIGGER
U$11 = MyBreadBoards:LOGOTOPHELIOS
X1-X4 X6 = Rembrandt Electronics - JST XH Connectors v1-0:JST-XH-02-PIN: JST XH Connector 2 Pin Wire to board connector. Pitch: 2,54 mm, (0.100") Number of pins: 2 Created by Rembrandt Electronics www.rembrandtelectronics.com
X5 = Rembrandt Electronics - JST XH Connectors v1-0:JST-XH-10-PIN: JST XH Connector 2 Pin Wire to board connector. Pitch: 2,54 mm, (0.100") Number of pins: 10 Created by Rembrandt Electronics www.rembrandtelectronics.com
X7 = Rembrandt Electronics - JST XH Connectors v1-0:JST-XH-03-PIN: JST XH Connector 2 Pin Wire to board connector. Pitch: 2,54 mm, (0.100") Number of pins: 3 Created by Rembrandt Electronics www.rembrandtelectronics.com

## Net classes
0 default: clearance 0.127 mm
1 power: width 0.127 mm, drill 0.305 mm
2 lowpower: width 0.254 mm, drill 0.483 mm
3 usbvcc: width 0.127 mm, drill 0.305 mm, clearance 0.254 mm to class 0, clearance 0.254 mm to class 1, clearance 0.254 mm to class 2, clearance 0.254 mm
4 ThermoDiode: clearance 0.025 mm